# Altium schematic sheet TopFinal(Circuit Diagram).SchDoc
size A; SheetNumber: 1; SheetTotal: 1
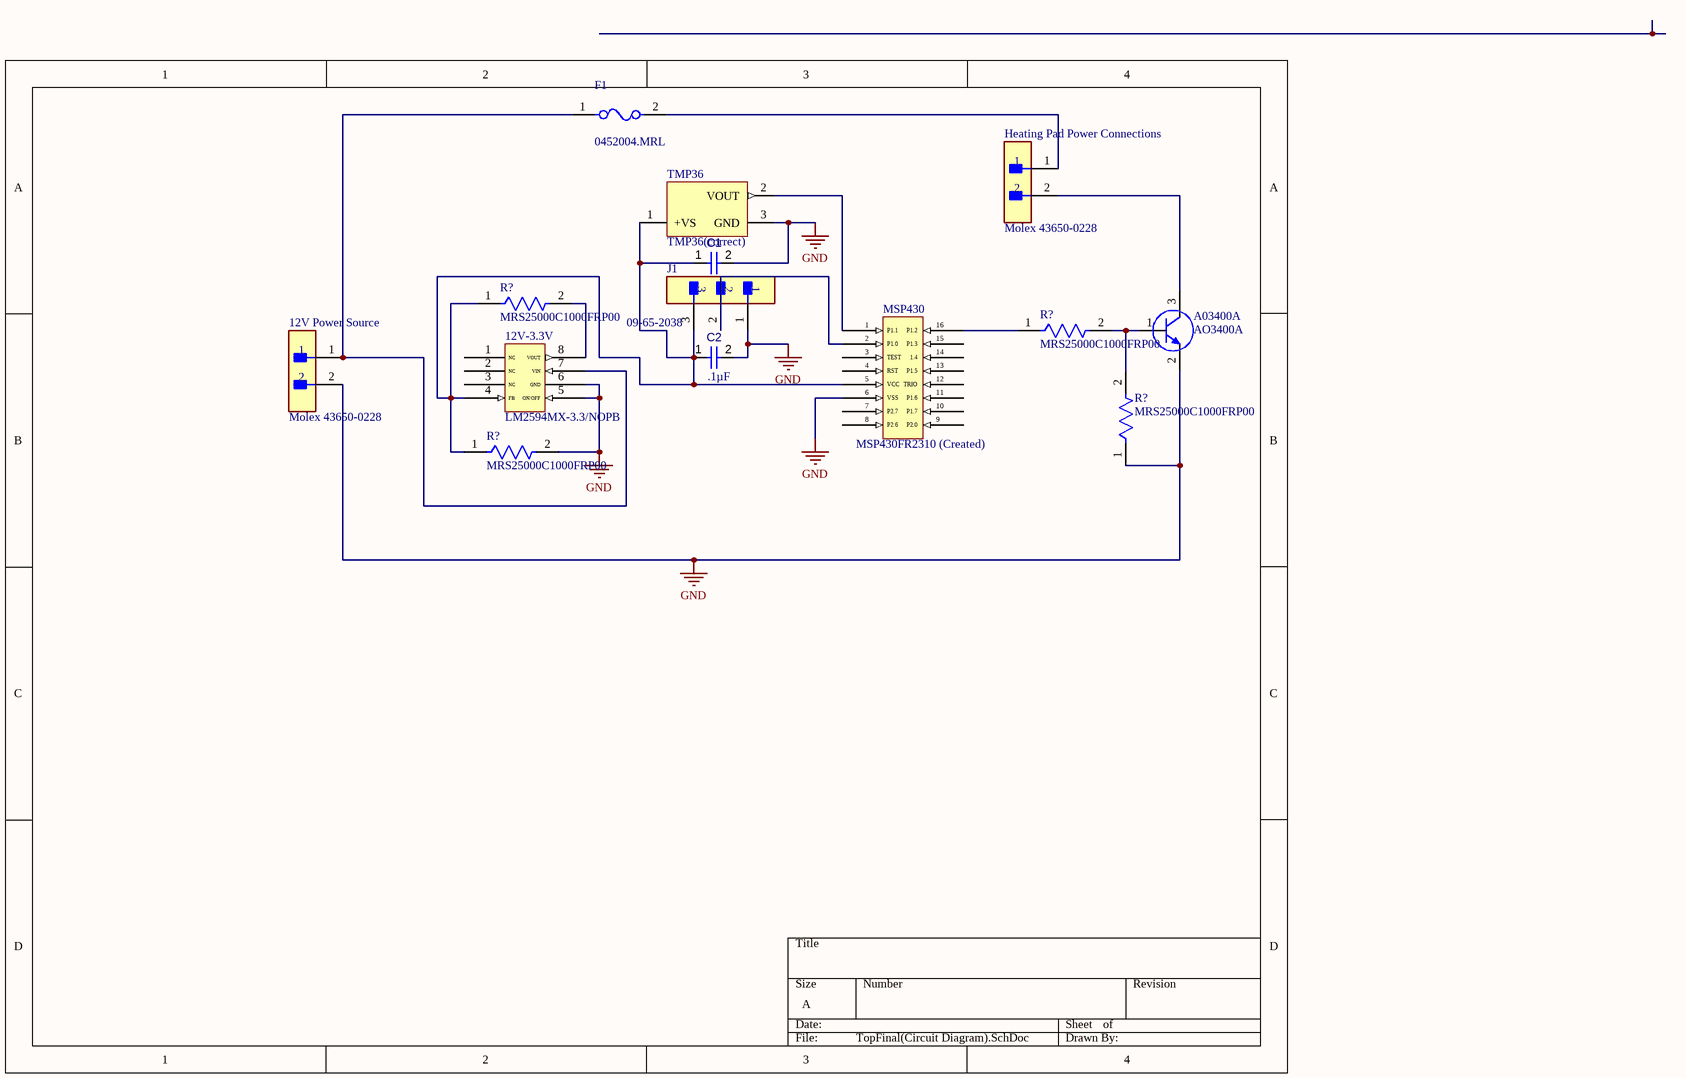
[diagram p0: TopFinal(Circuit Diagram).SchDoc]

## Parts
(Parts that share a designator on the sheet are numbered #1, #2 ... from top to bottom, then left to right.)
12V-3.3V  LM2594MX-3.3/NOPB  [FP-D0008A-IPC_B]
12V_Power_Source  Molex 43650-0228  [FP-436500228-MFG]
A03400A  AO3400A  [FP-SOT23-IPC_C]
C1  value .1µF  [CAPC2013X145X50ML20T25]  (hidden comment: Capacitor 1 uF +/- 10% 25 V 0805)
C2  value .1µF  [CAPC2013X145X50ML20T25]  (hidden comment: Capacitor 1 uF +/- 10% 25 V 0805)
F1  0452004.MRL  [FP-0452-MFG]
Heating_Pad_Power_Connections  Molex 43650-0228  [FP-436500228-MFG]
J1  09-65-2038  [FP-09-65-2038-MFG]
MSP430  MSP430FR2310 (Created)  [MSP430FR2310IPW16 (Created Footprint)]
R?#1  MRS25000C1000FRP00  [FP-MRS25-MFG]
R?#2  MRS25000C1000FRP00  [FP-MRS25-MFG]
R?#3  MRS25000C1000FRP00  [FP-MRS25-MFG]
R?#4  MRS25000C1000FRP00  [FP-MRS25-MFG]
TMP36  TMP36(correct)  [ADI-T-3]

## Nets
GND: 12V-3.3V.5(ON/OFF) 12V-3.3V.6(GND) 12V_Power_Source.2(Negative) A03400A.2(S) C1.2 C2.2 J1.1 MSP430.6(VSS) R?#3.2 R?#4.1 TMP36.3(GND)
Net12V-3.3V_4: 12V-3.3V.4(FB) C1.1 C2.1 J1.3 MSP430.5(VCC) R?#1.1 R?#3.1 TMP36.1(+VS)
Net12V-3.3V_7: 12V-3.3V.7(VIN) 12V_Power_Source.1(+) F1.1
Net12V-3.3V_8: 12V-3.3V.8(VOUT) R?#1.2
NetA03400A_1: A03400A.1(G) R?#2.2 R?#4.2
NetA03400A_3: A03400A.3(D) Heating_Pad_Power_Connections.2(Negative)
NetF1_2: F1.2 Heating_Pad_Power_Connections.1(+)
NetJ1_2: J1.2 MSP430.2(P1.0)
NetMSP430_1: MSP430.1(P1.1) TMP36.2(VOUT)
NetMSP430_16: MSP430.16(P1.2) R?#2.1

Not connected (* = marked no-connect by the designer): 12V-3.3V 1(NC) 2(NC) 3(NC); MSP430 3(TEST) 4(RST) 7(P2.7) 8(P2.6) 9(P2.0) 10(P1.7) 11(P1.6) 12(TRIO) 13(P1.5) 14(1.4) 15(P1.3)

## Library data of the parts
12V-3.3V = CMP-019-00049-1: Switching Regulator, Voltage-mode, 1.4A, 173kHz Switching Freq-Max, BIPolar, PDSO8; Package Equivalence Code: SOP8,.25; Qualification Status: Not Qualified; Nominal Output Voltage: 3.3V; Control Technique: PULSE WIDTH MODULATION; Min Input Voltage: 4.5V; Time @ Peak Reflow Temperature-Max (s): 40s; Channels: 1; Nominal Supply Voltage: 12V; Max Supply Voltage: 40V; Package Body Material: Plastic; Switcher Configuration: BUCK; JESD-609 Code: e3; Peak Reflow Temperature (Cel): 260°C; Pins: 8; Min Operating Temperature: -40°C; Control Mode: VOLTAGE-MODE; Terminal Form: Gull Wing; Terminal Position: DUAL; Temperature Grade: AUTOMOTIVE; Length: 4.9mm; Technology: BIPOLAR; Height - Seated (Max): 1.75mm; Reach SVHC Compliant: Yes; Max Output current: 1.4A; Width: 3.9mm; JESD-30 Code: R-PDSO-G8; RoHS Compliant: Yes; Package Style: SMALL OUTLINEMeter; Max Operating Temperature: 125°C; Terminal Pitch: 1.27mm; Terminal Finish: Tin; Throw Configuration: SWITCHING REGULATOR; Frequency: 173kHz; Package Shape: Rectangular; Case/Package: SOP; Moisture Sensitivity Level: 1; Surface Mount: Yes
12V_Power_Source Heating_Pad_Power_Connections = CMP-002-00071-1: Rectangular Power Connector, 2 Contact(s), Female, Solder Terminal MOLEX; Connector Type: Power,Rectangular; Min Operating Temperature: -40°C; Mounting Technology: Board; Max Operating Temperature: 105°C; RoHS Compliant: Yes
A03400A = CMP-013-00034-2: Small Signal Field-Effect Transistor, 5.7A I(D), 30V, 1-Element, N-Channel, Silicon, Metal-oxide Semiconductor FET; RoHS Compliant: Yes; Pins: 3
C1 C2 = CMP-001-00010-7: Chip Capacitor, 1 uF, +/-10%, 25 V, 0805 (2012 Metric); Capacitor Type: Ceramic; Voltage Rating: 25V; RoHS Compliant: True; Pins: 2; Mounting Technology: SM; Max Operating Temperature: 125°C; Min Operating Temperature: -55°C; Tolerance: 10%; Case/Package: 0805
F1 = CMP-08605-000077-1: FUSE BRD MNT 4A 125VAC/VDC 2SMD; Manufacturer: Littelfuse Inc; Max Fuse Dc Voltage: 125V; Fuse I2T: 34.4A2Sec; Fuse Interrupt Ac Current: 50A; Fuse Interrupt Dc Current: 300A; Fuse Blow Speed: Slow; Value: 0.0186Ω; Digikey Description: FUSE BRD MNT 4A 125VAC/VDC 2SMD; Voltage Rating: 125V; Height: 2.94mm; Device Class L2: Fuses; Lead Free: Yes; Manufacturer Part Number: 0452004.MRL; Automotive: No; Fuse Current: 4A; Device Class L3: unset; RoHS: TRUE; Max Fuse Ac Voltage: 125V; Temperature Range Low: -55°C; Category: Fuse; Device Class L1: Circuit Protection; ComponentLink2Description: Datasheet; Temperature: -55°C to +125°C; ComponentLink2URL: https://www.littelfuse.com/~/media/electronics/datasheets/fuses/littelfuse_fuse_452_454_datasheet.pdf.pdf; Temperature Range High: +125°C; Octopart: https://octopart.com/0452004.mrl-littelfuse-566421; Mouser Description: Surface Mount Fuses 125V 4A; Resistance: 0.0186Ω; Package: 0452
J1 = CMP-04776-000251-1: CONN HEADER VERT 3POS 3.96MM; Max Voltage Rating (AC): 250V; Gender: Male; Glow Wire Compliant: Non-compliant; Number of Contacts: 3; Contact Resistance: 10mR; Current Rating: 7A; Mating Cycles: 30; Pitch: 3.96mm; Radiation Hardening: No; Lead Free: Lead Free; Termination: Through Hole; Orientation: Straight; Housing Material: Nylon; RoHS Compliant: Yes; Number of Rows: 1; Color: Natural; Contact Material: Brass; Voltage Rating: 250V; Flammability Rating: UL94 V-2; Contact Gender: Male; Number of Positions: 3; Min Operating Temperature: -40°C; Package Quantity: 8000; Packaging: Bulk; Mount: Through Hole; Series: 5273; Contact Plating: Tin; Max Operating Temperature: 105°C; Halogen Free: Halogen Free; Housing Color: Natural; Voltage Rating (DC): 250V
MSP430 = CMP-020-00023-4: RISC Microcontroller, 16-Bit, FRAM, MSP430 CPU, 16MHz, CMOS, PDSO16; Peripherals: PWM; Max Supply Voltage: 3.6V; Package Body Material: Plastic; Nominal Supply Voltage: 2.2V; Min Supply Voltage: 1.8V; Interface: I2C,SPI,IrDA,UART; Number of I/O Lines: 11; Pins: 16; Terminal Position: DUAL; JESD-609 Code: e4; Package Shape: Rectangular; Max Operating Temperature: 85°C; Min Operating Temperature: -40°C; Length: 5mm; Clock Frequency: 16MHz; Case/Package: TSSOP; RoHS Compliant: Yes; Width: 4.4mm; Surface Mount: Yes; Terminal Pitch: 0.65mm; Reach SVHC Compliant: Yes; JESD-30 Code: R-PDSO-G16; Height - Seated (Max): 1.2mm; Terminal Finish: Nickel; Temperature Grade: INDUSTRIAL; Moisture Sensitivity Level: 2; Terminal Form: Gull Wing; Technology: CMOS
R?#1-R?#4 = CMP-00030-42757237-1: MRS25000C1000FRP00 Resistor, 100 Ohm, ± 1%, 600 mW, Axial Leaded, Metal Film (Thin Film), Professional; Max Power Dissipation: 600mW; Resistance: 100Ω; Voltage Rating: 350V; Temperature Coefficient: 50ppm/°C; Lead Diameter: 600µm; RoHS: Compliant; Radiation Hardening: No; Schedule B: 8533210090, 8533210090; Length: 6.5mm; Packaging: Tape & Reel (TR); Number of Terminations: 2; Mount: Through Hole; Width: 2.5mm; Tolerance: 1%; Military Standard: Not; Voltage Rating (DC): 350V; Contact Plating: Tin; Number of Pins: 2; Max Operating Temperature: 155°C; NexarPartId: 42757237; Diameter: 2.5mm; Composition: Metal Film, Thin Film; REACH SVHC: Unknown; Power Rating: 600mW; Lead Free: Lead Free; Termination: Axial; Case/Package: Axial; Min Operating Temperature: -55°C
TMP36 = CMP-010-00026-3: Analog Voltage Output Sensor, 0.1V Min, 2V Max, 4Cel, Rectangular, 3 Pin, Through Hole Mount; Min Supply Voltage: 2.7V; Max Supply Voltage: 5.5V; Sensor Type: TEMPERATURE SENSOR,ANALOG,VOLTAGE OUTPUT; Mounting Technology: Through Hole; Pins: 3; RoHS Compliant: Yes; Min Operating Temperature: -55°C; Max Operating Temperature: 125°C